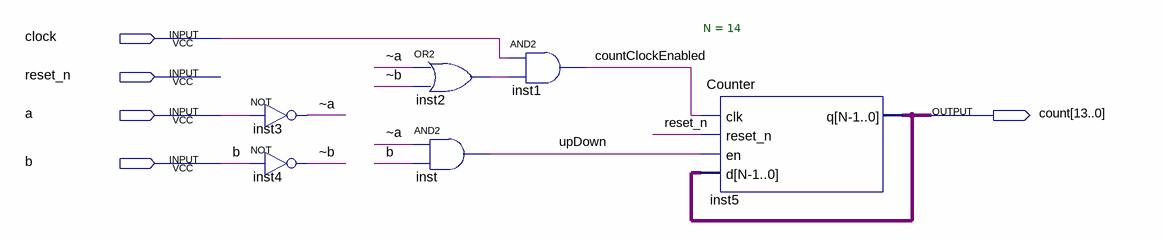
[diagram p0: schematic sheet]
// Quartus schematic ArrowLogicCounter.bdf as structural Verilog: 6 symbols, 5 pins
module ArrowLogicCounter (
  input  clock,
  input  reset_n,
  input  a,
  input  b,
  output [13:0] count
);

  wire countClockEnabled, inst2_out, upDown, \~a , \~b ;

  not inst3 (\~a , a);
  not inst4 (\~b , b);
  or inst2 (inst2_out, \~a , \~b );
  and inst (upDown, \~a , b);
  and inst1 (countClockEnabled, clock, inst2_out);
  Counter #(.N(14)) inst5 (.clk(countClockEnabled), .reset_n(reset_n), .en(upDown), .d(count), .q(count));
endmodule
